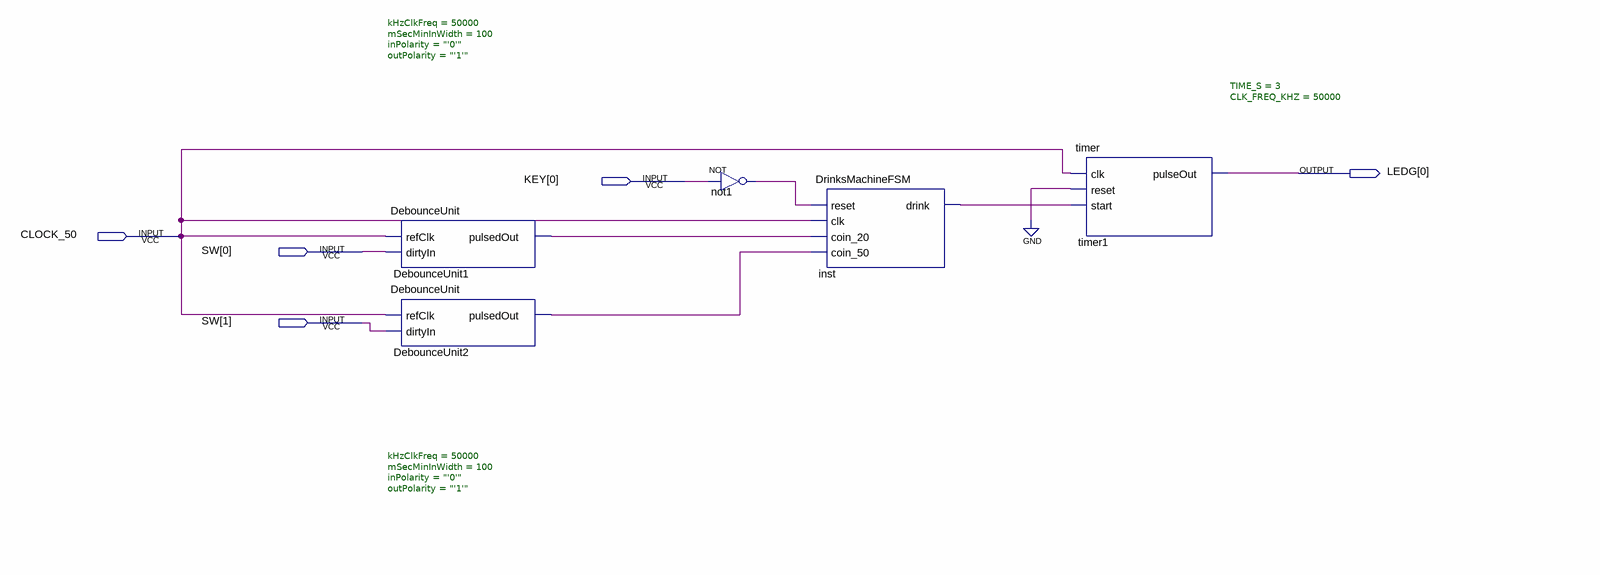
[diagram p0: schematic sheet]
// Quartus schematic DrinksMachine.bdf as structural Verilog: 5 symbols, 5 pins
module DrinksMachine (
  input  [0:0] KEY,
  input  CLOCK_50,
  input  [1:0] SW,
  output [0:0] LEDG
);

  wire DebounceUnit1_pulsedout, DebounceUnit2_pulsedout, inst_drink, not1_out;

  DebounceUnit #(.kHzClkFreq(50000), .mSecMinInWidth(100), .inPolarity("'0'"), .outPolarity("'1'")) DebounceUnit1 (
    .refClk(CLOCK_50), .dirtyIn(SW[0]), .pulsedOut(DebounceUnit1_pulsedout));
  DebounceUnit #(.kHzClkFreq(50000), .mSecMinInWidth(100), .inPolarity("'0'"), .outPolarity("'1'")) DebounceUnit2 (
    .refClk(CLOCK_50), .dirtyIn(SW[1]), .pulsedOut(DebounceUnit2_pulsedout));
  not not1 (not1_out, KEY[0]);
  DrinksMachineFSM inst (
    .reset(not1_out), .clk(CLOCK_50), .coin_20(DebounceUnit1_pulsedout), .coin_50(DebounceUnit2_pulsedout),
    .drink(inst_drink));
  timer #(.TIME_S(3), .CLK_FREQ_KHZ(50000)) timer1 (
    .clk(CLOCK_50), .reset(1'b0), .start(inst_drink), .pulseOut(LEDG[0]));
endmodule
